# EAGLE design ziffy_board_v6 (EAGLE 6.5.0)
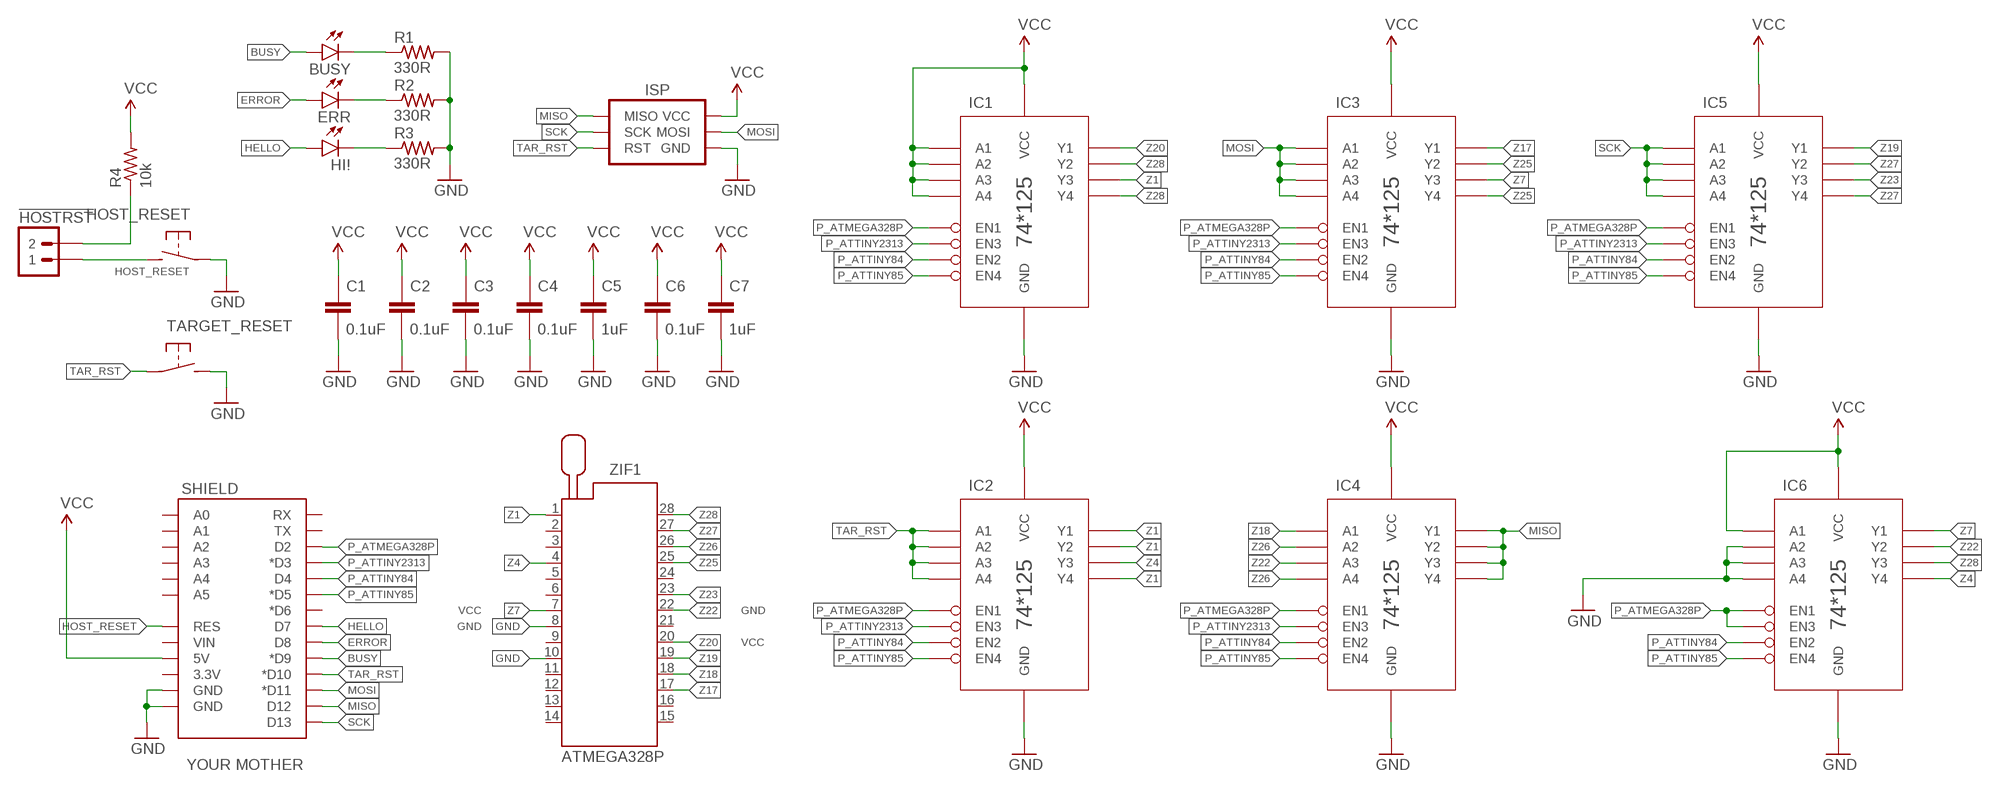
[diagram p0: schematic, sheet 1]

## Parts
!HOSTRST  M02PTH  [1X02]
BUSY  YELLOW  LED3MM  [LED3MM]
C1  0.1uF  CAPACITOR-CERAMIC025-024X044  [C025-024X044]
C2  0.1uF  CAPACITOR-CERAMIC025-024X044  [C025-024X044]
C3  0.1uF  CAPACITOR-CERAMIC025-024X044  [C025-024X044]
C4  0.1uF  CAPACITOR-CERAMIC025-024X044  [C025-024X044]
C5  1uF  CAPACITOR-CERAMIC025-024X044  [C025-024X044]
C6  0.1uF  CAPACITOR-CERAMIC025-024X044  [C025-024X044]
C7  1uF  CAPACITOR-CERAMIC025-024X044  [C025-024X044]
ERR  RED  LED3MM  [LED3MM]
HI!  GREEN  LED3MM  [LED3MM]
HOST_RESET  SPST-NO-TACT6MM-PTH-SMALL-PADS  [DTS-6-SMALL-PADS]
IC1  74HC125  74125SOIC14  [SO14]
IC2  74HC125  74125SOIC14  [SO14]
IC3  74HC125  74125SOIC14  [SO14]
IC4  74HC125  74125SOIC14  [SO14]
IC5  74HC125  74125SOIC14  [SO14]
IC6  74HC125  74125SOIC14  [SO14]
ISP  AVR_SPI_PRG_6PTH-SHROUD  [2X3-SHROUDED]
R1  330R  RESISTORPTH-AXIAL-5.08MM  [RESISTOR-AXIAL-PTH-5.08MM]
R2  330R  RESISTORPTH-AXIAL-5.08MM  [RESISTOR-AXIAL-PTH-5.08MM]
R3  330R  RESISTORPTH-AXIAL-5.08MM  [RESISTOR-AXIAL-PTH-5.08MM]
R4  10k  RESISTORPTH-AXIAL-5.08MM  [RESISTOR-AXIAL-PTH-5.08MM]
SHIELD  YOUR MOTHER  ARDUINO_SHIELD_SMALLER  [ARDUINO_SHIELD_NOOUTLINE_INSIDE_SMALLER]
TARGET_RESET  SPST-NO-TACT6MM-PTH-SMALL-PADS  [DTS-6-SMALL-PADS]
ZIF1  ATMEGA328P  ZIF28  [ZIF28]

## Nets
BUSY: BUSY.A SHIELD.D9(*D9)
ERROR: ERR.A SHIELD.D8
GND: C1.2 C2.2 C3.2 C4.2 C5.2 C6.2 C7.2 HOST_RESET.1 HOST_RESET.2 IC1.7(GND) IC2.7(GND) IC3.7(GND) IC4.7(GND) IC5.7(GND) IC6.5(A2) IC6.7(GND) IC6.9(A3) IC6.12(A4) ISP.6(GND) R1.P$2 R2.P$2 R3.P$2 SHIELD.GND@0(GND) SHIELD.GND@1(GND) TARGET_RESET.3 TARGET_RESET.4 ZIF1.8 ZIF1.10
HELLO: HI!.A SHIELD.D7
HOST_RESET: !HOSTRST.1 HOST_RESET.3 HOST_RESET.4 SHIELD.RES
MISO: IC4.3(Y1) IC4.6(Y2) IC4.8(Y3) IC4.11(Y4) ISP.1(MISO) SHIELD.D12
MOSI: IC3.2(A1) IC3.5(A2) IC3.9(A3) IC3.12(A4) ISP.4(MOSI) SHIELD.D11(*D11)
N$1: BUSY.K(C) R1.P$1
N$2: ERR.K(C) R2.P$1
N$3: HI!.K(C) R3.P$1
N$4: !HOSTRST.2 R4.P$1
P_ATMEGA328P: IC1.1(EN1) IC2.1(EN1) IC3.1(EN1) IC4.1(EN1) IC5.1(EN1) IC6.1(EN1) IC6.10(EN3) SHIELD.D2
P_ATTINY84: IC1.4(EN2) IC2.4(EN2) IC3.4(EN2) IC4.4(EN2) IC5.4(EN2) IC6.4(EN2) SHIELD.D4
P_ATTINY85: IC1.13(EN4) IC2.13(EN4) IC3.13(EN4) IC4.13(EN4) IC5.13(EN4) IC6.13(EN4) SHIELD.D5(*D5)
P_ATTINY2313: IC1.10(EN3) IC2.10(EN3) IC3.10(EN3) IC4.10(EN3) IC5.10(EN3) SHIELD.D3(*D3)
SCK: IC5.2(A1) IC5.5(A2) IC5.9(A3) IC5.12(A4) ISP.3(SCK) SHIELD.D13
TAR_RST: IC2.2(A1) IC2.5(A2) IC2.9(A3) IC2.12(A4) ISP.5(RST) SHIELD.D10(*D10) TARGET_RESET.1 TARGET_RESET.2
VCC: C1.1 C2.1 C3.1 C4.1 C5.1 C6.1 C7.1 IC1.2(A1) IC1.5(A2) IC1.9(A3) IC1.12(A4) IC1.14(VCC) IC2.14(VCC) IC3.14(VCC) IC4.14(VCC) IC5.14(VCC) IC6.2(A1) IC6.14(VCC) ISP.2(VCC) R4.P$2 SHIELD.5V
Z1: IC1.8(Y3) IC2.3(Y1) IC2.6(Y2) IC2.11(Y4) ZIF1.1
Z4: IC2.8(Y3) IC6.11(Y4) ZIF1.4
Z7: IC3.8(Y3) IC6.3(Y1) ZIF1.7
Z17: IC3.3(Y1) ZIF1.17
Z18: IC4.2(A1) ZIF1.18
Z19: IC5.3(Y1) ZIF1.19
Z20: IC1.3(Y1) ZIF1.20
Z22: IC4.9(A3) IC6.6(Y2) ZIF1.22
Z23: IC5.8(Y3) ZIF1.23
Z25: IC3.6(Y2) IC3.11(Y4) ZIF1.25
Z26: IC4.5(A2) IC4.12(A4) ZIF1.26
Z27: IC5.6(Y2) IC5.11(Y4) ZIF1.27
Z28: IC1.6(Y2) IC1.11(Y4) IC6.8(Y3) ZIF1.28
Unconnected: SHIELD.3.3V SHIELD.A0 SHIELD.A1 SHIELD.A2 SHIELD.A3 SHIELD.A4 SHIELD.A5 SHIELD.D6(*D6) SHIELD.RX SHIELD.TX SHIELD.VIN ZIF1.2 ZIF1.3 ZIF1.5 ZIF1.6 ZIF1.9 ZIF1.11 ZIF1.12 ZIF1.13 ZIF1.14 ZIF1.15 ZIF1.16 ZIF1.21 ZIF1.24

## Notes on the sheet
- VCC | GND
- GND
- VCC

## Library data of the parts
!HOSTRST = A_butts:M02: Standard 2-pin 0.1" header. Use with - straight break away headers ( PRT-00116) - right angle break away headers (PRT-00553) - swiss pins (PRT-00743) - machine pins (PRT-00117) - female headers (PRT-00115) Molex polarized connector foot print use with: PRT-08233 with associated crimp pins and housings. 2.54_SCREWTERM for use with PRT-10571. 3.5mm Screw Terminal footprints for PRT-08084 5mm Screw Terminal footprints for use with PRT-08433
BUSY ERR HI! = A_butts:LED: LEDs Standard schematic elements and footprints for 5mm, 3mm, 1206, and 0603 sized LEDs. 5mm - Spark Fun Electronics SKU : COM-00529 (and others)
C1-C7 = A_butts:CAPACITOR-CERAMIC: CAPACITOR, European symbol
HOST_RESET TARGET_RESET = A_butts:SPST-NO-TACT
IC1-IC6 = A_butts:74*125
ISP = A_butts:AVR_SPI_PRG_6: AVR ISP 6 Pin This is the reduced ISP connector for AVR programming. Common on Arduino. This footprint will take up less PCB space and can be used with a 10-pin to 6-pin adapter such as SKU: BOB-08508 **Special note about "TEST_POINT" package. The stop mask is on the top side, so if you want your programming test points to be on the bottom of your board, make sure to place this package on the bottom side of the board. This also ensure that the orientation to program from the bottom side will be correct.
R1-R4 = A_butts:RESISTOR: RESISTOR, American symbol
SHIELD = A_butts:ARDUINO_SHIELD_SMALLER
ZIF1 = A_butts:ZIF28: Zero Insertion Force Socked Source: http://www.3M.com/ehpd

## Board
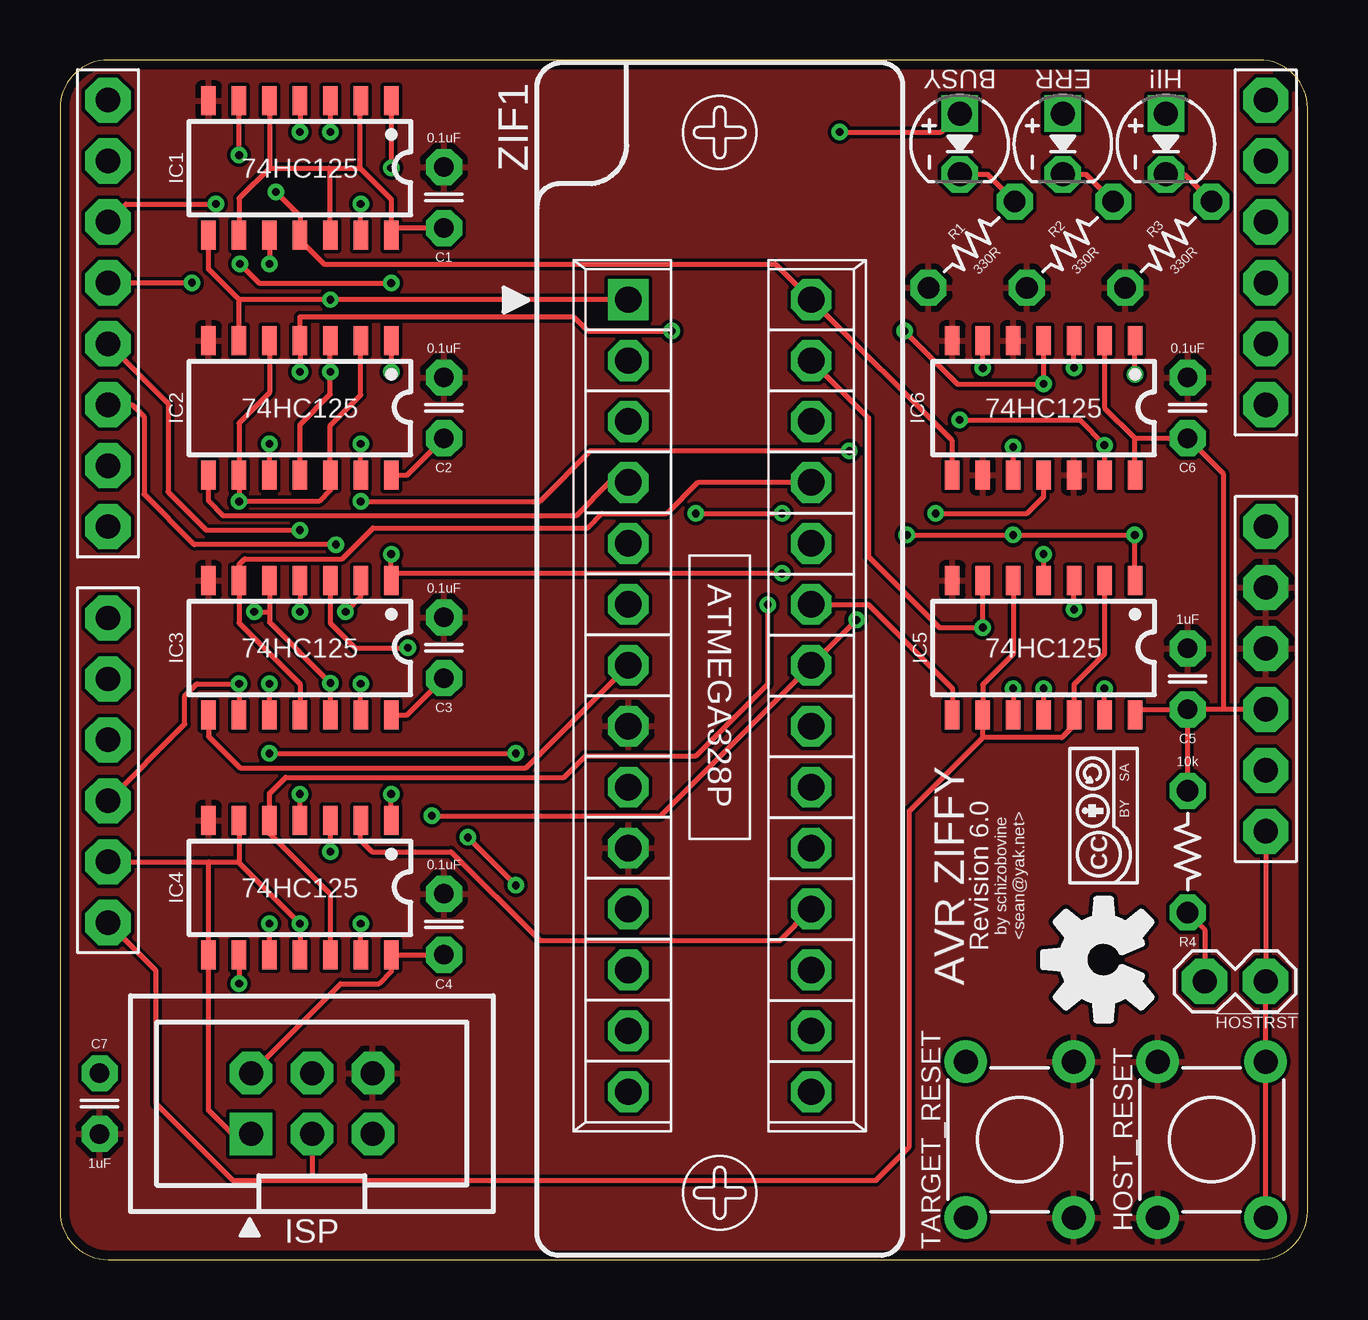
[diagram p1: board, top side]
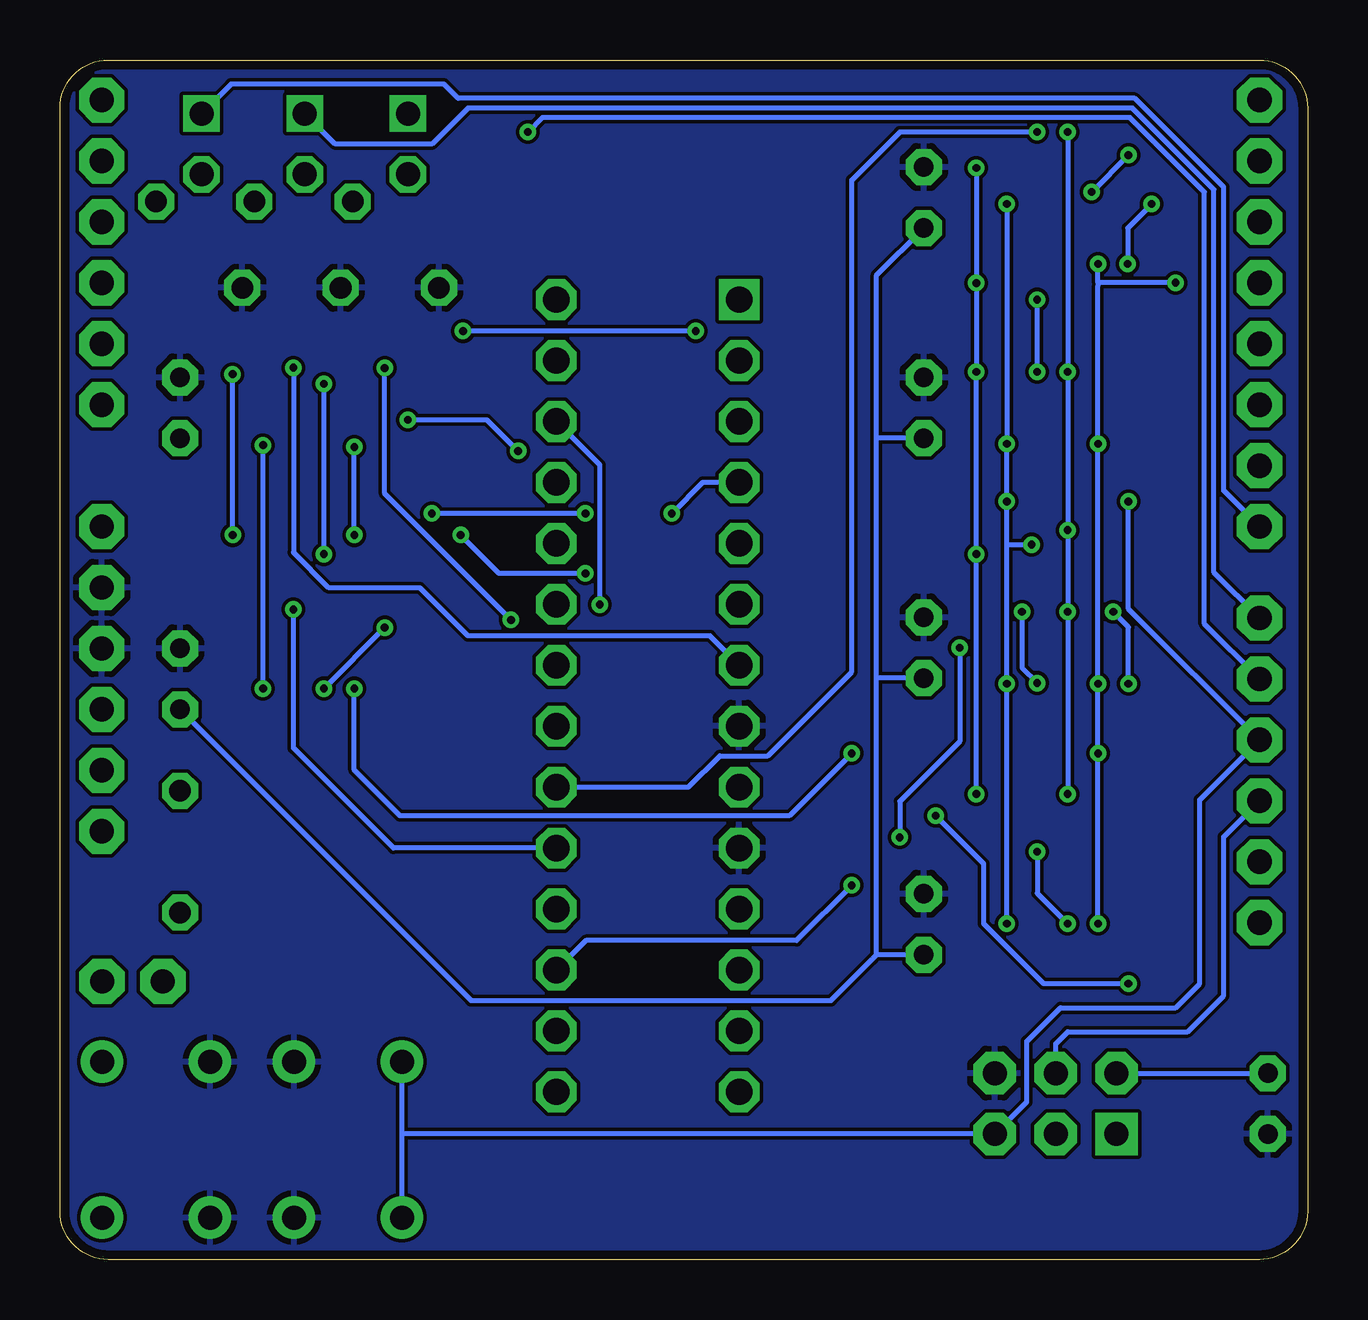
[diagram p2: board, bottom side, seen from below]

Size 52 x 50 mm. Coordinates in mm from the lower left corner, seen from the top.
Outline: 0,48 0,2 arc90 2,0 50,0 arc90 52,2 52,48 arc90 50,50 2,50 arc90 0,48
Copper layers (1*16): Top 0.0356mm / dielectric 1.5011mm / Bottom 0.0356mm
Design rules "LaenPCBOrder_2": minimum track width 6mil, minimum drill 13mil, track to track 6mil, track to pad 6mil, pad to pad 6mil, via to via 6mil, smd to smd 6mil, copper to edge 15mil, drill to drill 6mil, minimum pad ring 7mil, minimum via ring 7mil, stop-mask expansion 3mil, vias tented up to drill 20mil, thermal gap 10mil

### Footprints (pad centres in the part's own frame; a part is rotated, then mirrored left to right if it is on the bottom)
1X02 = drill 1 pad 1.88 octagon: 1 0,0; 2 2.54,0
LED3MM = drill 1 pad 1.524 square: A -1.27,0 | drill 1 pad 1.524 octagon: K 1.27,0
C025-024X044 = drill 0.813 pad 1.5 octagon: 1 -1.27,0; 2 1.27,0
DTS-6-SMALL-PADS = drill 1 pad 1.778: 1 -3.25,2.25; 2 3.25,2.25; 3 -3.25,-2.25; 4 3.25,-2.25
SO14 = smd 0.6 x 1.2: 1 -3.81,-2.8; 2 -2.54,-2.8; 3 -1.27,-2.8; 4 0,-2.8; 5 1.27,-2.8; 6 2.54,-2.8; 7 3.81,-2.8; 8 3.81,2.8; 9 2.54,2.8; 10 1.27,2.8; 11 0,2.8; 12 -1.27,2.8; 13 -2.54,2.8; 14 -3.81,2.8
2X3-SHROUDED = drill 1 pad 1.778 square: 1 -1.27,2.54 | drill 1 pad 1.778 octagon: 2 1.27,2.54; 3 -1.27,0; 4 1.27,0; 5 -1.27,-2.54; 6 1.27,-2.54
RESISTOR-AXIAL-PTH-5.08MM = drill 0.9 pad 1.5 octagon: P$1 -2.54,0; P$2 2.54,0
ARDUINO_SHIELD_NOOUTLINE_INSIDE_SMALLER = drill 1.016 pad 1.88 octagon: 3.3V 48.26,-27.94; 5V 48.26,-25.4; A0 48.26,-12.7; A1 48.26,-10.16; A2 48.26,-7.62; A3 48.26,-5.08; A4 48.26,-2.54; A5 48.26,0; D2 0,-5.08; D3 0,-7.62; D4 0,-10.16; D5 0,-12.7; D6 0,-15.24; D7 0,-17.78; D8 0,-21.59; D9 0,-24.13; D10 0,-26.67; D11 0,-29.21; D12 0,-31.75; D13 0,-34.29; GND@0 48.26,-22.86; GND@1 48.26,-20.32; RES 48.26,-30.48; RX 0,0; TX 0,-2.54; VIN 48.26,-17.78
ZIF28 = drill 1.1 pad 1.7 square: 1 -16.51,-3.81 | drill 1.1 pad 1.7 octagon: 2 -13.97,-3.81; 3 -11.43,-3.81; 4 -8.89,-3.81; 5 -6.35,-3.81; 6 -3.81,-3.81; 7 -1.27,-3.81; 8 1.27,-3.81; 9 3.81,-3.81; 10 6.35,-3.81; 11 8.89,-3.81; 12 11.43,-3.81; 13 13.97,-3.81; 14 16.51,-3.81; 15 16.51,3.81; 16 13.97,3.81; 17 11.43,3.81; 18 8.89,3.81; 19 6.35,3.81; 20 3.81,3.81; 21 1.27,3.81; 22 -1.27,3.81; 23 -3.81,3.81; 24 -6.35,3.81; 25 -8.89,3.81; 26 -11.43,3.81; 27 -13.97,3.81; 28 -16.51,3.81

### Placement (x,y rotation side)
!HOSTRST  50.25,11.59 180 top
BUSY  37.5,46.5 270 top
C1  16,44.27 90 top
C2  16,35.5 90 top
C3  16,25.5 90 top
C4  16,13.97 90 top
C5  47,24.2 90 top
C6  47,35.5 90 top
C7  1.65,6.5 270 top
ERR  41.8,46.5 270 top
HI!  46.1,46.5 270 top
HOST_RESET  48,5 90 top
IC1  10,45.5 180 top
IC2  10,35.5 180 top
IC3  10,25.5 180 top
IC4  10,15.5 180 top
IC5  41,25.5 180 top
IC6  41,35.5 180 top
ISP  10.5,6.5 90 top
R1  38,42.3 225 top
R2  42.1,42.3 225 top
R3  46.2,42.3 225 top
R4  47,17 90 top
SHIELD  2,48.33 0 top
TARGET_RESET  40,5 90 top
U$1  [CC-BY-SA-4.0-NO-URL]  43.5,18.5 90 top
U$2  [OSHWLOGO_TOP_0.2_A]  43.5,12.5 90 top
ZIF1  27.5,23.5 270 top

### Tracks (layer width: path | path; a pad name or v marks a point on that pad's centre or on a via)
BUSY  (via drill 0.33)
  Top 0.2: v32.5,47 36.73,47 BUSY.A
  Bottom 0.2: SHIELD.D9 4.3,26.5 4.3,44.5 7.4,47.6 31.9,47.6 v32.5,47
ERROR
  Bottom 0.2: SHIELD.D8 3.9,28.64 3.9,44.6 7.3,48 35,48 36.5,46.5 40.53,46.5 ERR.A
GND
  pour Top: 50,0 2,0 arc-90 0,2 0,48 arc-90 2,50 50,50 arc-90 52,48 52,2 arc-90
  pour Bottom: 50,0 2,0 arc-90 0,2 0,48 arc-90 2,50 50,50 arc-90 52,48 52,2 arc-90
HELLO
  Bottom 0.2: SHIELD.D7 3.5,32.05 3.5,44.7 7.2,48.4 35.4,48.4 36,49 44.87,49 HI!.A
HOST_RESET
  Top 0.2: HOST_RESET.3 HOST_RESET.4 !HOSTRST.1 SHIELD.RES
MISO  (via drill 0.33)
  Top 0.2: ISP.1 7.17,5.23 6.19,6.21 6.19,12.4 | 6.19,12.4 IC4.8 6.19,16.57 6.2,16.58 | 6.18,12.4 6.19,12.4 | IC4.3 v11.27,17 | IC4.11 v10,14 7.46,16.54 | IC4.6 7.46,16.54 | SHIELD.D12 6.2,16.58 | 6.2,16.58 7.42,16.58 7.46,16.54
  Bottom 0.2: v11.27,17 11.27,15.27 v10,14
MOSI  (via drill 0.33)
  Top 0.2: SHIELD.D11 5.2,22.32 5.2,23.5 5.7,24 v7.46,24 IC3.9 | IC3.5 8.73,27 | 8.73,27 8.73,26.57 v11.27,24.03 IC3.12 | IC3.2 12.54,27.64 v11.9,27 | v8.1,27 8.73,27
  Bottom 0.2: ISP.4 10.5,9 10,9.5 5,9.5 3.5,11 3.5,17.62 SHIELD.D11 | v11.9,27 11.9,24.66 v11.27,24.03 | v7.46,24 7.46,26.36 v8.1,27
N$1
  Top 0.2: BUSY.K 38.66,45.23 R1.P$1
N$2
  Top 0.2: ERR.K 42.76,45.23 R2.P$1
N$3
  Top 0.2: HI!.K 46.86,45.23 R3.P$1
N$4
  Top 0.2: R4.P$1 47.71,13.75 !HOSTRST.2
P_ATMEGA328P  (via drill 0.33)
  Top 0.2: IC3.1 13.81,28.6 | 13.81,28.6 v13.81,29.4 | IC2.1 v13.81,37 | IC1.1 v13.81,45.5 | v7.5,41.5 8.3,40.7 v13.81,40.7 | IC4.1 v13.81,19.4 | v30.1,28.6 13.81,28.6 | v35.3,30.2 v39.73,30.2 v44.8,30.2 IC5.1 | IC6.10 v39.73,33.87 | v44.81,36.9 IC6.1 | SHIELD.D2 2.75,44 v6.5,44
  Bottom 0.2: v13.81,45.5 v13.81,40.7 v13.81,37 v13.81,29.4 v13.81,19.4 | v30.1,28.6 33.7,28.6 v35.3,30.2 | v39.73,30.2 v39.73,33.87 | v44.8,30.2 v44.8,36.89 v44.81,36.9 | v6.5,44 7.5,43 v7.5,41.5
P_ATTINY84  (via drill 0.33)
  Top 0.2: IC1.4 v10,47 | v10,37 IC2.4 10,39.3 21.4,39.3 22,38.7 v25.5,38.7 | IC3.4 v10,27 | IC4.4 v10,19.4 | SHIELD.D4 4.5,35.67 4.5,32 6.1,30.4 v10,30.4 | IC5.4 v41,29.4 | IC6.4 v41,36.5 37.4,36.5 v35.2,38.7
  Bottom 0.2: v10,19.4 v10,27 v10,30.4 v10,37 v10,47 | v25.5,38.7 v35.2,38.7 | v41,29.4 v41,36.5
P_ATTINY85  (via drill 0.33)
  Top 0.2: IC2.13 v12.54,34 | IC4.13 v12.54,14 | IC3.13 v12.54,24 | IC1.13 v12.54,44 | SHIELD.D5 3,35.63 3.5,35.13 3.5,31.9 5.6,29.8 v11.5,29.8 | v32.9,33.7 22.1,33.7 20,31.6 v12.54,31.6 | IC5.13 v43.54,23.8 | v37.5,35 42.5,35 42.5,34.98 v43.54,33.94 IC6.13
  Bottom 0.2: v12.54,44 v12.54,34 v12.54,31.6 12.54,29.8 | 12.54,29.8 v12.54,24 v12.54,14 | 12.54,29.8 v11.5,29.8 | v43.54,23.8 v43.54,33.94 | v32.9,33.7 34.2,35 v37.5,35
P_ATTINY2313  (via drill 0.33)
  Top 0.2: IC3.10 v8.73,24 | IC4.10 v8.73,14 | IC2.10 v8.73,34 | IC1.10 v8.73,41.5 | v8.73,21.1 v19,21.1 | v39.73,23.8 IC5.10 | SHIELD.D3 v5.5,40.71
  Bottom 0.2: 8.73,40.71 v8.73,41.5 | v8.73,14 v8.73,21.1 v8.73,24 v8.73,34 8.73,40.6 8.73,40.71 | v19,21.1 21.6,18.5 37.83,18.5 39.73,20.4 v39.73,23.8 | v5.5,40.71 8.73,40.71
SCK
  Top 0.2: SHIELD.D13 4,12.04 4,6.5 7.2,3.3 10.5,3.3 | 10.5,3.3 34,3.3 35.4,4.7 35.4,18.7 38.46,21.76 | ISP.3 10.5,3.3 | 38.46,21.76 IC5.9 38.46,23.96 39.73,25.23 IC5.5 | 38.46,21.76 41.76,21.76 42.27,22.27 IC5.12 42.27,23.97 43.54,25.24 IC5.2
TAR_RST  (via drill 0.33)
  Top 0.2: IC2.2 12.54,36.04 11.27,34.77 IC2.12 11.27,32.07 10.8,31.6 v7.46,31.6 IC2.9 7.46,34.86 8.73,36.13 IC2.5
  Bottom 0.2: TARGET_RESET.1 37.75,5.3 | 37.75,5.3 TARGET_RESET.2 | 37.75,5.3 37.68,5.23 ISP.5 11.7,6.57 11.7,9.1 10.3,10.5 5.5,10.5 4.5,11.5 4.5,19.16 SHIELD.D10 7.46,27.12 v7.46,31.6
VCC
  Top 0.2: ISP.2 11.69,11.5 13.3,11.5 13.81,12.01 IC4.14 C4.1 | IC1.5 8.73,45.5 | 8.73,45.5 7.46,44.23 IC1.9 | 8.73,45.5 11.2,45.5 | 11.2,45.5 12.5,45.5 | 12.5,45.5 12.5,48.26 IC1.2 | IC1.12 11.27,45.43 11.2,45.5 | IC5.14 45.04,22.93 C5.1 | 12.5,45.5 13.81,44.19 13.81,43 | 13.81,43 IC1.14 | IC3.14 14.47,22.7 C3.1 | IC2.14 14.47,32.7 C2.1 | C1.1 13.81,43 | SHIELD.5V 48.5,22.93 | 48.5,22.93 C5.1 | R4.P$2 C5.1 | 48.5,22.93 48.5,32.73 C6.1 44.81,34.23 | IC6.2 43.54,35.5 44.81,34.23 | IC6.14 44.81,34.23
  Bottom 0.2: 17.96,12.7 17.96,24.23 | 17.96,24.23 17.96,34.23 | 17.96,34.23 17.96,41.04 C1.1 | ISP.2 C7.1 | C3.1 17.96,24.23 | C2.1 17.96,34.23 | C5.1 34.87,10.8 19.86,10.8 18.13,12.53 17.96,12.7 | C4.1 17.96,12.7
Z1  (via drill 0.33)
  Top 0.2: IC2.11 10,34.8 11.27,36.07 v11.27,37 IC2.3 | ZIF1.1 v11.27,40.01 7.46,40.01 | IC1.8 6.19,41.28 7.46,40.01 | IC2.6 7.46,40.01
  Bottom 0.2: v11.27,37 v11.27,40.01
Z4  (via drill 0.33)
  Top 0.2: IC2.8 6.19,31.63 6.82,31 21.5,31 22.89,32.39 ZIF1.4 | v26.5,31.1 v30.1,31.1 | IC6.11 41,31.8 40.3,31.1 v36.5,31.1
  Bottom 0.2: ZIF1.4 25.21,32.39 v26.5,31.1 | v30.1,31.1 v36.5,31.1
Z7  (via drill 0.33)
  Top 0.2: IC3.8 6.19,21.81 7.5,20.5 19.42,20.5 ZIF1.7 | v42.27,37.17 IC6.3
  Bottom 0.2: ZIF1.7 23.69,24.79 24.9,26 35,26 37,28 40.8,28 42.27,29.47 v42.27,37.17
Z17  (via drill 0.33)
  Top 0.2: v17,17.6 v19,15.6 | IC3.3 11.27,26.53 12.3,25.5 v14.5,25.5
  Bottom 0.2: v17,17.6 17,19.1 14.5,21.6 v14.5,25.5 | v19,15.6 21.3,13.3 30.08,13.3 ZIF1.17
Z18
  Top 0.2: IC4.2 12.54,17.46 13,17 16.3,17 20,13.3 30,13.3 ZIF1.18
Z19  (via drill 0.33)
  Top 0.2: v42.27,27.1 IC5.3
  Bottom 0.2: ZIF1.19 38.1,17.15 42.27,21.32 v42.27,27.1
Z20  (via drill 0.33)
  Top 0.2: IC1.3 v11.27,47
  Bottom 0.2: v11.27,47 17,47 19,45 19,24.5 22.5,21 24.5,21 25.81,19.69 ZIF1.20
Z22  (via drill 0.33)
  Top 0.2: IC4.9 v7.46,11.5 | v15.5,18.5 25.04,18.5 ZIF1.22 v33.2,26.66 | v38.46,37.16 IC6.6
  Bottom 0.2: v7.46,11.5 11,11.5 13.5,14 13.5,16.5 v15.5,18.5 | v33.2,26.66 38.46,31.92 v38.46,37.16
Z23
  Top 0.2: ZIF1.23 33.69,27.31 37.19,23.81 IC5.8
Z25
  Top 0.2: IC3.11 10,24 7.46,26.54 IC3.6 7.46,28.96 7.7,29.2 11.75,29.2 13.05,30.5 22,30.5 22.6,31.1 25.3,31.1 26.6,32.4 ZIF1.25
Z26  (via drill 0.33)
  Top 0.2: IC4.12 11.27,15.23 8.73,17.77 IC4.5 8.73,19.43 9.4,20.1 21,20.1 21.9,21 26.5,21 29.5,24 v29.5,27.3
  Bottom 0.2: ZIF1.26 29.5,33.12 v29.5,27.3
Z27  (via drill 0.33)
  Top 0.2: IC5.11 v41,23.8 | IC5.6 v38.46,26.34 36.66,26.34 33.7,29.3 33.7,35.08 ZIF1.27
  Bottom 0.2: v41,23.8 v38.46,26.34
Z28  (via drill 0.33)
  Top 0.2: v7.46,46.04 IC1.6 | v9,44.5 10,43.5 IC1.11 10,42.5 11,41.5 29.82,41.5 ZIF1.28 37.19,34.13 IC6.8
  Bottom 0.2: v7.46,46.04 v9,44.5

### Text on the board
tPlace: AVR ZIFFY | Revision 6.0 | by schizobovine / <sean@yak.net>